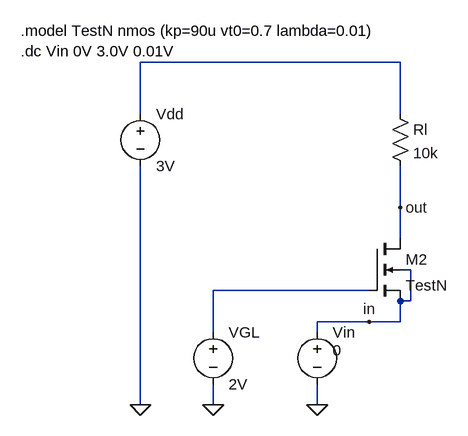
[diagram p0: schematic common-gate.asc]
common-gate.asc, the LTspice schematic file:
Version 4
SHEET 1 880 1412
WIRE -96 800 -496 800
WIRE -496 880 -496 800
WIRE -96 880 -96 800
WIRE -96 1024 -96 960
WIRE -96 1072 -96 1024
WIRE -80 1120 -96 1120
WIRE -144 1152 -384 1152
WIRE -80 1168 -80 1120
WIRE -80 1168 -96 1168
WIRE -144 1200 -224 1200
WIRE -96 1200 -96 1168
WIRE -96 1200 -144 1200
WIRE -384 1216 -384 1152
WIRE -224 1216 -224 1200
WIRE -496 1328 -496 960
WIRE -384 1328 -384 1296
WIRE -224 1328 -224 1296
FLAG -496 1328 0
FLAG -224 1328 0
FLAG -96 1024 out
FLAG -144 1200 in
FLAG -384 1328 0
SYMBOL voltage -224 1200 R0
WINDOW 3 24 44 Left 2
SYMATTR Value 0
SYMATTR InstName Vin
SYMBOL voltage -496 864 R0
WINDOW 123 0 0 Left 2
WINDOW 39 0 0 Left 2
SYMATTR InstName Vdd
SYMATTR Value 3V
SYMBOL nmos4 -144 1072 R0
SYMATTR InstName M2
SYMATTR Value TestN
SYMATTR Value2 l=10u w=100u
SYMBOL res -112 864 R0
SYMATTR InstName Rl
SYMATTR Value 10k
SYMBOL voltage -384 1200 R0
WINDOW 123 0 0 Left 2
WINDOW 39 0 0 Left 2
SYMATTR InstName VGL
SYMATTR Value 2V
TEXT -680 752 Left 2 !.model TestN nmos (kp=90u vt0=0.7 lambda=0.01)\n.dc Vin 0V 3.0V 0.01V

The netlist it stands for:
* common-gate.asc
Vin in 0 0
Vdd N001 0 3V
M2 out N002 in in TestN l=10u w=100u
Rl N001 out 10k
VGL N002 0 2V
.model NMOS NMOS
.model PMOS PMOS
.lib standard.mos
.model TestN nmos (kp=90u vt0=0.7 lambda=0.01)
.dc Vin 0V 3.0V 0.01V
.backanno
.end